# Altium schematic sheet Rs232.SchDoc
size A4; Organization: Altium Limited; Address1: L3, 12a Rodborough Rd; Address2: Frenchs Forest; Address3: NSW; Address4: Australia 2086; DocumentNumber: 2; SheetNumber: 2; SheetTotal: 7
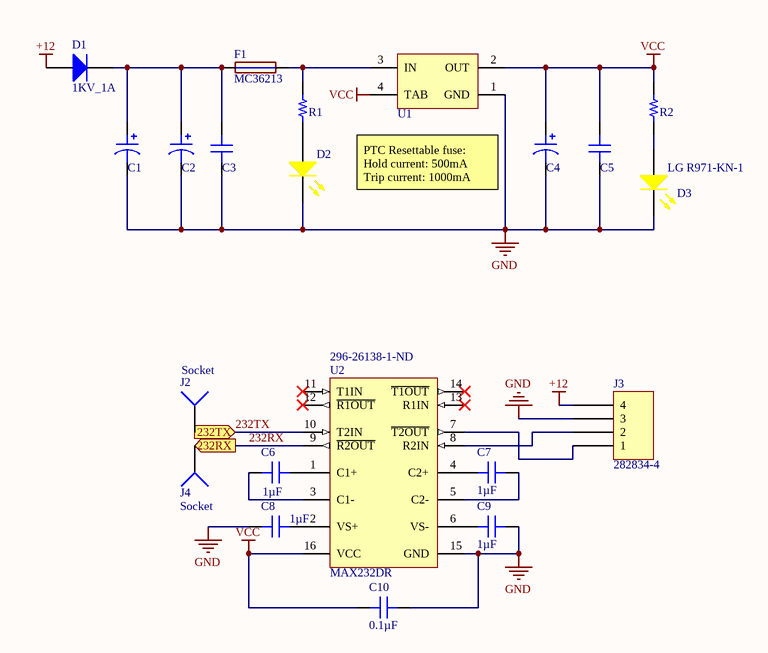
[diagram p0: Rs232.SchDoc]

## Parts
C1  UVY1C471MPD  [Cap 6.3x11 THT]  (value not drawn)
C2  UVY1C471MPD  [Cap 6.3x11 THT]  (value not drawn)
C3  C0805C475K9PAC7210  [CAP SMD 0805]  (value not drawn)
C4  UVY1C471MPD  [Cap 6.3x11 THT]  (value not drawn)
C5  C0805C475K9PAC7210  [CAP SMD 0805]  (value not drawn)
C6  value 1µF  [CAP SMD 0805]  (hidden comment: C0805C105K5RACAUTO)
C7  value 1µF  [CAP SMD 0805]  (hidden comment: C0805C105K5RACAUTO)
C8  value 1µF  [CAP SMD 0805]  (hidden comment: C0805C105K5RACAUTO)
C9  value 1µF  [CAP SMD 0805]  (hidden comment: C0805C105K5RACAUTO)
C10  value 0.1µF  [CAP SMD 0805]  (hidden comment: C0805C104M5RAC7025)
D1  1KV_1A  [Diod DO-214AC]
D2  LS R976-NR-1  [LED 0805]  (value not drawn)
D3  LG R971-KN-1  [LED 0805]
F1  value MC36213  [AP2-00002]  (hidden comment: Farnell no: 1861197)
J2  Socket  [PIN1]
J3  282834-4  [CONN. 4]
J4  Socket  [PIN1]
R1  10K  [RES SMD 0805]  (value not drawn)
R2  1K  [RES SMD 0805]  (value not drawn)
U1  LM1117IMP-5.0/NOPB  [ON SEMI SOT-223 ST(318H)]  (value not drawn)
U2  MAX232DR  Supplier Part Number 1: 296-26138-1-ND  [SOIC 16]

## Ports
232RX (out), 232TX (in)

## Nets
+12: D1.2(ANODE) J3.4
GND: C1.2 C2.2 C3.1 C4.2 C5.1 C8.1 C9.2 C10.2 D2.1(Cathode) D3.1(Cathode) J3.3 U1.1(GND) U2.15(GND)
VCC: C4.1 C5.2 C10.1 R2.2 U1.2(OUT) U1.4(TAB) U2.16(VCC)
232RX: J4.1 U2.9(~{R2OUT}) ; port 232RX
232TX: J2.1 U2.10(T2IN) ; port 232TX
NetC1_1: C1.1 C2.1 C3.2 D1.1(CATHODE) F1.1
NetC6_1: C6.1 U2.3(C1-)
NetC6_2: C6.2 U2.1(C1+)
NetC7_1: C7.1 U2.4(C2+)
NetC7_2: C7.2 U2.5(C2-)
NetC8_2: C8.2 U2.2(VS+)
NetC9_1: C9.1 U2.6(VS-)
NetD2_2: D2.2(Anode) R1.1
NetD3_2: D3.2(Anode) R2.1
NetF1_2: F1.2 R1.2 U1.3(IN)
NetJ3_1: J3.1 U2.7(~{T2OUT})
NetJ3_2: J3.2 U2.8(R2IN)

Not connected (* = marked no-connect by the designer): U2 11(T1IN)* 12(~{R1OUT})* 13(R1IN)* 14(~{T1OUT})*

## Notes on the sheet
- PTC Resettable fuse:
  Hold current: 500mA
  Trip current: 1000mA
- Title
- Size:
- Date:
- A4
- Number:
- Time:
- Revision:
- Sheet
- of
- File:

## Library data of the parts
C1 C2 C4 = POLARIZED CAP: CAP ALUM 470UF 20% 16V RADIAL
C3 C5 = CAPACITOR X7R: 4.7 µF ±10% 6.3V Ceramic Capacitor X5R 0805 (2012 Metric)
C6-C9 = 12065C105JAT2A: 1 µF ±10% 50V Ceramic Capacitor X7R 0805 (2012 Metric); Manufacturer: AVX Corporation; Tolerance: ±5%; Part Number: 12065C105JAT2A; Applications: General Purpose; Capacitance: 1µF; ComponentLink1Description: Datasheet; ComponentLink1URL: http://datasheets.avx.com/X7RDielectric.pdf; ComponentLink2Description: DigiKey Link; ComponentLink2URL: http://digikey.com/product-detail/en/avx-corporation/12065C105JAT2A/478-10884-1-ND/7536453; Device Package: 1206 (3216 Metric); LastUpdated: 1/21/2020 12:03:49 AM; Lifecycle Status: Active; Minimum Order: 1; Mounting Type: Surface Mount, MLCC; Operating Temperature: -55°C ~ 125°C; Package / Case: 1206 (3216 Metric); Packaging: TapeAndReel; PartId: 19654; Part Status: Active; Price: 0.15; Series: -; Size / Dimension: 0.126" L x 0.063" W (3.20mm x 1.60mm); Supplier 1: DigiKey; Supplier Part Number 1: 478-10884-1-ND; Temperature Coefficient: X7R; Thickness (Max): 0.070" (1.78mm); Voltage - Rated: 50V
C10 = C1206C104K5RAC7025: 0.1 µF ±20% 50V Ceramic Capacitor X7R 0805 (2012 Metric); Manufacturer: KEMET; Tolerance: ±10%; Part Number: C1206C104K5RAC7025; Applications: Bypass, Decoupling; Capacitance: 0.1µF; ComponentLink1Description: Datasheet; ComponentLink1URL: https://api.kemet.com/component-edge/download/datasheet/C1206C104K5RAC7025.pdf; ComponentLink2Description: DigiKey Link; ComponentLink2URL: http://digikey.com/product-detail/en/kemet/C1206C104K5RAC7025/399-7356-1-ND/5322076; Device Package: 1206 (3216 Metric); LastUpdated: 1/21/2020 12:03:23 AM; Lifecycle Status: Active; Minimum Order: 1; Mounting Type: Surface Mount, MLCC; Operating Temperature: -55°C ~ 125°C; Package / Case: 1206 (3216 Metric); Packaging: TapeAndReel; PartId: 18895; Part Status: Active; Price: 0.02; Series: SMD Comm X7R; Size / Dimension: 0.126" L x 0.063" W (3.20mm x 1.60mm); Supplier 1: DigiKey; Supplier Part Number 1: 399-7356-1-ND; Temperature Coefficient: X7R; Thickness (Max): 0.035" (0.88mm); Voltage - Rated: 50V
D1 = Diod DO-214AC: DIODE GEN PURP 1KV 1A SMA  S1M; Published: 8-Jun-2000; LatestRevisionDate: 17-Jul-2002; LatestRevisionNote: Re-released for DXP Platform.; PackageVersion: Sep-1996; PackageReference: SMC; Publisher: Altium Limited; PackageDescription: DO-214-AB/SMC; 2 C-Bend Leads; Body 7.9 x 5.9 mm, inc. leads (LxW); Code_JEDEC: DO-214-AB
D2 = SMD LED INDICATORS: LED RED DIFFUSED 0805 SMD
D3 = SMD LED INDICATORS: LED GREEN DIFFUSED 0805 SMD
F1 = FUSE: Resetable PTC fuse, Ih = 0.5A, It = 1.0A, 0805 package; PartGroup: Resistors,Resettable fuses,SMD; Manufacturer: Multicomp; AN: A02-0622; TemperatureRange: -40°C to + 85°C; Height: 1,25; MPN: MC36213
J3 = 282834-4: TERM BLOCK HDR 4POS 90DEG 5.08MM; Manufacturer: TE Connectivity AMP Connectors; Current: 10A; Mating Orientation: Horizontal with Board; Number of Levels: 1; Pitch: 0.100" (2.54mm); Positions Per Level: 4; Voltage: 150V; Wire Gauge: 16-30 AWG; Wire Termination: Screw - Rising Cage Clamp; Part Number: 282834-4; Color: Green; ComponentLink1Description: Datasheet; ComponentLink1URL: https://www.te.com/commerce/DocumentDelivery/DDEController?Action=srchrtrv&DocNm=282834&DocType=Customer+Drawing&DocLang=English; ComponentLink2Description: DigiKey Link; ComponentLink2URL: http://digikey.com/product-detail/en/te-connectivity-amp-connectors/282834-4/A98335-ND/1153265; LastUpdated: 1/15/2020 4:16:05 AM; Lifecycle Status: Active; Minimum Order: 1; Mounting Type: Through Hole; Packaging: Bulk; Part Status: Active; Price: 2.68; Series: Buchanan; Supplier 1: DigiKey; Supplier Part Number 1: A98335-ND
R1 = RESISTOR: RES SMD 10K OHM 1% 1/4W 0805
R2 = RESISTOR: RES SMD 1K OHM 1% 1/4W 0805
U1 = LM1117IMP-5.0/NOPB: 800mA Low-Dropout Linear Regulator, 4-pin SOT-223, Pb-Free; Manufacturer: National Semiconductor; PackageTopMarking: XYTT*N06B; PowerWise: N; CompType: LDO IC; High-Reliability: Y; DatasheetVersion: Apr-2006; PackageVersion: revB, Apr-2003; PackageReference: MP04A; PackageDescription: Molded SOT-223, 6.50 x 3.56 x 1.6mm Body, 4 Lead, 2.3mm Pitch; PartNumber: LM1117IMP-5.0/NOPB; RoHS: Y; PinCount: 4; Code_JEDEC: TO-261-AA; Code_IPC: SOT223-4; ComponentLink1Description: Manufacturer URL; ComponentLink1URL: http://www.national.com/; ComponentLink2Description: LM1117 Datasheet; ComponentLink2URL: http://www.national.com/ds/LM/LM1117.pdf; ComponentLink3Description: LM1117 Web Page; ComponentLink3URL: http://www.national.com/pf/LM/LM1117.html; ComponentLink4Description: MP04A Package Page; ComponentLink4URL: http://www.national.com/packaging/folders/mp04a.html
U2 = MAX232DR: IC TRANSCEIVER FULL 2/2 16SOIC; Manufacturer 1: Texas Instruments; Manufacturer Part Number 1: MAX232ECDR; SubFamily: RS-232; Drivers Per Package: 2; Supply Voltage(s)(V): 5; ESD HBM(kV): +/-2; ICC(Max)(mA): 10; Single Supply: TRUE; Nominal Supply Current: 10mA; Data Rate: 120Kbps; Operating Supply Voltage: 5V; Min Supply Voltage: 4.5V; Max Supply Voltage: 5.5V; Logic Function: Transceiver,Receiver; Number of Transceivers: 1; Number of I/Os: 8; Propagation Delay: 0.5us; Simplex/Duplex: Full Duplex; DatasheetVersion: SLLS047L; PackageVersion: revM, Jun-2011; PackageReference: D16; PackageDescription: 16-Pin Plastic Small Outline Integrated Circuit, 9.9 x 3.9 mm, Pitch 1.27 mm Pitch; Receivers Per Package: 2; RS-232: TRUE; ComponentLink1Description: Manufacturer URL; ComponentLink1URL: www.ti.com; ComponentLink2Description: Datasheet; ComponentLink2URL: http://www.ti.com/general/docs/lit/getliterature.tsp?genericPartNumber=MAX232&fileType=pdf; ComponentLink3Description: Package Specification; ComponentLink3URL: http://www.ti.com/litv/pdf/mpds178g; Supplier 1: Digi-Key; Stock 1: 2544; Pricing 1: 1=1.09000, 10=0.97600, 25=0.92680, 100=0.71170, 250=0.62892, 500=0.59580, 1000=0.46340 (USD); RoHS: Yes; Mount: Surface Mount; Case/Package: D; Number of Pins: 16; Min Operating Temperature: -40°C; Max Operating Temperature: 85°C; Packaging: Tape and Reel; Number of Drivers: 2; Package Quantity: 1; Number of Receivers: 2; Number of Transmitters: 2; Radiation Hardening: No; REACH SVHC: No SVHC; Lead Free: Lead Free; ComponentLink4URL: https://datasheet.ciiva.com/4783/slls723b-121575-4783681.pdf?src-supplier=Mouser; ComponentLink4Description: https://datasheet.ciiva.com/4783/slls723b-121575-4783681.pdf?src-supplier=Mouser; ComponentLink5URL: https://datasheet.ciiva.com/41461/001187142-da-01-en-ic-dual-rs232-esd-max232ecdr-soic-16-tid-41461900.pdf?src-supplier=Conrad; ComponentLink5Description: https://datasheet.ciiva.com/41461/001187142-da-01-en-ic-dual-rs232-esd-max232ecdr-soic-16-tid-41461900.pdf?src-supplier=Conrad; ComponentLink6URL: https://datasheet.ciiva.com/1701/max232e-1701542.pdf?src-supplier=Digi-Key; ComponentLink6Description: https://datasheet.ciiva.com/1701/max232e-1701542.pdf?src-supplier=Digi-Key; ComponentLink7URL: https://datasheet.ciiva.com/14427/slls723b-14427158.pdf?src-supplier=Avnet; ComponentLink7Description: https://datasheet.ciiva.com/14427/slls723b-14427158.pdf?src-supplier=Avnet; ComponentLink8URL: https://datasheet.ciiva.com/1701/max232e-1701543.pdf?src-supplier=Digi-Key; ComponentLink8Description: https://datasheet.ciiva.com/1701/max232e-1701543.pdf?src-supplier=Digi-Key; ComponentLink9URL: https://datasheet.ciiva.com/1701/max232e-1701544.pdf?src-supplier=Digi-Key; ComponentLink9Description: https://datasheet.ciiva.com/1701/max232e-1701544.pdf?src-supplier=Digi-Key; ComponentLink10URL: https://datasheet.ciiva.com/46397/1864431-46397208.pdf?src-supplier=Element14; ComponentLink10Description: https://datasheet.ciiva.com/46397/1864431-46397208.pdf?src-supplier=Element14; ComponentLink11URL: https://datasheet.ciiva.com/15224/getdatasheetpartid-82083-15224955.pdf?src-supplier=Verical; ComponentLink11Description: https://datasheet.ciiva.com/15224/getdatasheetpartid-82083-15224955.pdf?src-supplier=Verical
J2 J4 = Socket: LatestRevisionDate: 17-Jul-2002; LatestRevisionNote: Re-released for DXP Platform.; Publisher: Altium Limited